# Altium schematic sheet PowerMonitors.SchDoc
size A; SheetNumber: 5; SheetTotal: 6
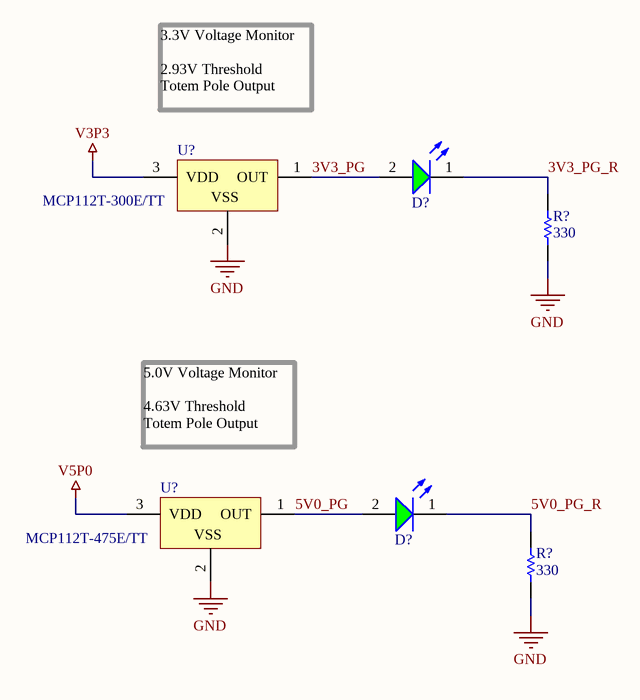
[diagram p0: PowerMonitors.SchDoc]

## Parts
(Parts that share a designator on the sheet are numbered #1, #2 ... from top to bottom, then left to right.)
D?#1  150080GS75000  [WL-SMCW_0805_150080xx75000]  (value not drawn)
D?#2  150080GS75000  [WL-SMCW_0805_150080xx75000]  (value not drawn)
R?#1  Resistance: 330  [RESC2013X60X35LL10T20]  (hidden comment: RC0805FR-07330RL)
R?#2  Resistance: 330  [RESC2013X60X35LL10T20]  (hidden comment: RC0805FR-07330RL)
U?#1  MCP112T-300E/TT  [SOT-23-TT3_L]
U?#2  MCP112T-475E/TT  [SOT-23-TT3_L]

## Nets
GND: R?#1.1 R?#2.1 U?#1.2(VSS) U?#2.2(VSS)
V3P3: U?#1.3(VDD)
V5P0: U?#2.3(VDD)
3V3_PG: D?#1.2(A) U?#1.1(OUT)
3V3_PG_R: D?#1.1(K) R?#1.2
5V0_PG: D?#2.2(A) U?#2.1(OUT)
5V0_PG_R: D?#2.1(K) R?#2.2

## Notes on the sheet
- 3.3V Voltage Monitor
  2.93V Threshold
  Totem Pole Output
- 5.0V Voltage Monitor
  4.63V Threshold
  Totem Pole Output

## Library data of the parts
D?#1 D?#2 = CMP-1426-00007-2: LED GREEN CLEAR 0805 SMD; NexarPartId: 29717780; Manufacturer: Wurth Electronics; Wavelength: 520nm; Forward Current: 100mA; Lens Style: Clear, Rectangular; Dominant Wavelength: 525nm; Max Junction Temperature (Tj): 95°C; Power Dissipation: 105mW; Luminous Intensity: 450mcd; Peak Wavelength: 515nm; Viewing Angle: 140°; Test Current: 20mA; Reverse Voltage: 5V; Forward Voltage: 3.2V; Lens Color: Colorless; Lens Size: 1.25mm; Mount: Surface Mount; REACH SVHC: Unknown; Min Operating Temperature: -40°C; Case Code (Imperial): 0805; Case/Package: 0805; Max Operating Temperature: 85°C; RoHS: Compliant; Length: 2mm; Height: 700µm; Width: 1.25mm; Color: Green; Case Code (Metric): 2012; Packaging: Tape and Reel; Max Reverse Voltage (DC): 5V; Supplier: Digikey; Supplier Part Number: 732-4983-1-ND; Manufacturer Part Number: 150080GS75000; Category: LEDs; Stock: 34895; Pricing: 1=0.19, 50=0.176, 100=0.151, 500=0.131 (USD); Mounting Technology: Surface Mount; Package Quantity: 1; Series: WL-SMCW; Lens Transparency: Clear; RoHS Compliant: Yes; Reach SVHC Compliant: Unknown; ComponentLink1URL: https://datasheet.ciiva.com/29563/150080gs75000-29563008.pdf?src-supplier=Digikey; ComponentLink1Description: https://datasheet.ciiva.com/29563/150080gs75000-29563008.pdf?src-supplier=Digikey; ComponentLink2URL: https://datasheet.ciiva.com/29279/759434-da-01-en-chipled-0805-w-kl-gruen-150080gs75000-29279039.pdf?src-supplier=Conrad; ComponentLink2Description: https://datasheet.ciiva.com/29279/759434-da-01-en-chipled-0805-w-kl-gruen-150080gs75000-29279039.pdf?src-supplier=Conrad
R?#1 R?#2 = CMP-2000-06960-1: Chip Resistor, 330 Ohm, +/- 1%, 125 mW, -55 to 155 degC, 0805 (2012 Metric), RoHS, Tape and Reel; Manufacturer: Yageo; Manufacturer Part Number: CRCW0805330RFKEA; Voltage Rating: 150V; Temperature Coefficient: 100PPM/C; Power Rating: 125mW(1/8W); Max Power Dissipation: 125mW; Value: 330R; Datasheet Version: Rev. 7, 05/2017; Termination Style: SMD/SMT; Case Code - mm: 2012; Package Description: 2-Pin Surface Mounted Device, Body 2 x 1.25 mm; Operating Temperature Range: -55Cto+155C; Case Code - in: 0805; Packaging: Reel; Tolerance: 1%; Package Reference: 0805; Mounting Technology: SurfaceMount; Product: ThickFilmResistorsGeneralPurpose; Series: RC; Manufacturer URL: http://www.yageo.com/; Datasheet URL: http://www.yageo.com/documents/recent/PYu-RC_Group_51_RoHS_L_7.pdf; Supplier 1: Digi-Key; Supplier Part Number 1: 311-330CRCT-ND; Manufacturer 1: Yageo; Manufacturer Part Number 1: RC0805FR-07330RL; RoHS: Yes; Category: Chip SMD Resistors; Stock 1: 1297787; Pricing 1: 1=0.10000, 10=0.03700, 100=0.01510, 1000=0.00680, 2500=0.00590 (USD); Case/Package: 0805; Case Code (Imperial): 0805; Case Code (Metric): 2012; Size Code: 0805; Min Operating Temperature: -55°C; Max Operating Temperature: 155°C; Package Quantity: 5000; Termination: SMD/SMT; Construction: Rectangular; Resistor Type: Thick Film; Number of Terminations: 2; Features: Moisture Resistant; Resistance Tolerance: 1%; Length: 0.079inch; Width: 0.049inch; Height: 0.024inch; Depth: 1.25mm; RoHS Compliant: Yes; Military Standard: Not; Lead Free: Lead Free; ComponentLink1URL: https://datasheet.ciiva.com/2457/pyu-r-int-thick-7-2457015.pdf?src-supplier=Digi-Key; ComponentLink1Description: https://datasheet.ciiva.com/2457/pyu-r-int-thick-7-2457015.pdf?src-supplier=Digi-Key; ComponentLink2URL: https://datasheet.ciiva.com/2457/pyu-r-int-thick-7-2457016.pdf?src-supplier=Digi-Key; ComponentLink2Description: https://datasheet.ciiva.com/2457/pyu-r-int-thick-7-2457016.pdf?src-supplier=Digi-Key; ComponentLink3URL: https://datasheet.ciiva.com/2457/pyu-r-int-thick-7-2457014.pdf?src-supplier=Digi-Key; ComponentLink3Description: https://datasheet.ciiva.com/2457/pyu-r-int-thick-7-2457014.pdf?src-supplier=Digi-Key; ComponentLink4URL: https://datasheet.ciiva.com/12667/rc0805-12667925.pdf?src-supplier=Mouser; ComponentLink4Description: https://datasheet.ciiva.com/12667/rc0805-12667925.pdf?src-supplier=Mouser; ComponentLink5URL: https://datasheet.ciiva.com/7941/444164-7941768.pdf?src-supplier=Element14; ComponentLink5Description: https://datasheet.ciiva.com/7941/444164-7941768.pdf?src-supplier=Element14; ComponentLink6URL: https://datasheet.ciiva.com/7941/444164-7941769.pdf?src-supplier=Element14; ComponentLink6Description: https://datasheet.ciiva.com/7941/444164-7941769.pdf?src-supplier=Element14; ComponentLink7URL: https://datasheet.ciiva.com/16740/rc0805-16740975.pdf?src-supplier=Future+Electronics; ComponentLink7Description: https://datasheet.ciiva.com/16740/rc0805-16740975.pdf?src-supplier=Future+Electronics; Supplier: Newark; Supplier Part Number: 53K0164; Stock: 218356; Pricing: 1=0.02, 25=0.02, 50=0.02, 100=0.02 (USD); Contact Plating: Tin; Weight: 0.000194oz; Voltage Rating (DC): 150V; Ratings: AEC-Q200; Reach SVHC Compliant: Unknown; ComponentLink8URL: https://datasheet.ciiva.com/5545/dcrcwe3-109170-5545357.pdf?src-supplier=Mouser; ComponentLink8Description: https://datasheet.ciiva.com/5545/dcrcwe3-109170-5545357.pdf?src-supplier=Mouser; ComponentLink9URL: https://datasheet.ciiva.com/8944/dcrcwe3-8944773.pdf?src-supplier=Avnet; ComponentLink9Description: https://datasheet.ciiva.com/8944/dcrcwe3-8944773.pdf?src-supplier=Avnet; ComponentLink10URL: https://datasheet.ciiva.com/8944/dcrcwe3-8944776.pdf?src-supplier=Avnet; ComponentLink10Description: https://datasheet.ciiva.com/8944/dcrcwe3-8944776.pdf?src-supplier=Avnet; ComponentLink11URL: https://datasheet.ciiva.com/2495/dcrcwe3-2495803.pdf?src-supplier=Digi-Key; ComponentLink11Description: https://datasheet.ciiva.com/2495/dcrcwe3-2495803.pdf?src-supplier=Digi-Key; ComponentLink12URL: https://datasheet.ciiva.com/2495/dcrcwe3-2495804.pdf?src-supplier=Digi-Key; ComponentLink12Description: https://datasheet.ciiva.com/2495/dcrcwe3-2495804.pdf?src-supplier=Digi-Key; ComponentLink13URL: https://datasheet.ciiva.com/2495/dcrcwe3-2495805.pdf?src-supplier=Digi-Key; ComponentLink13Description: https://datasheet.ciiva.com/2495/dcrcwe3-2495805.pdf?src-supplier=Digi-Key; ComponentLink14URL: https://datasheet.ciiva.com/16769/70201119-16769852.pdf?src-supplier=Allied+Electronics; ComponentLink14Description: https://datasheet.ciiva.com/16769/70201119-16769852.pdf?src-supplier=Allied+Electronics; ComponentLink15URL: https://datasheet.ciiva.com/7777/1697337-7777390.pdf?src-supplier=Element14; ComponentLink15Description: https://datasheet.ciiva.com/7777/1697337-7777390.pdf?src-supplier=Element14; ComponentLink16URL: https://datasheet.ciiva.com/7777/1720486-7777573.pdf?src-supplier=Element14; ComponentLink16Description: https://datasheet.ciiva.com/7777/1720486-7777573.pdf?src-supplier=Element14
U?#1 = CMP-0130-00043-1: 1.75Î¼A Micropower Voltage Detector, Push-Pull Output, 2.93V, 3-Pin SOT-23, Extended Temperature, Tape and Reel; Manufacturer 1: Microchip; Max Supply Voltage: 5.5V; Min Supply Voltage: 1V; Number of Voltages Monitored: 1; Operating Supply Current: 1.75uA; Reset: Active Low; Watchdog Timer: No; Max Reset Threshold Voltage: 2.974V; Min Reset Threshold Voltage: 2.886V; Quiescent Current: 1uA; Output: TOTEM-POLE; Code_IPC: SOT23-3; DatasheetVersion: revD, Jun-2005; PackageVersion: revBB, Aug-2009; PackageDescription: 3-Lead Plastic Small Outline Transistor (TT) [SOT-23]; PackageReference: SOT-23-TT3; Supplier 1: Digi-Key; Supplier Part Number 1: MCP112T-300E/TTCT-ND; Manufacturer Part Number 1: MCP112T-300E/TT; RoHS: Yes; Category: Voltage Supervisors; Stock 1: 3000; Pricing 1: 1=0.47000 (USD); Mount: Surface Mount; Case/Package: SOT-23-3; Number of Pins: 3; Min Operating Temperature: -40°C; Max Operating Temperature: 125°C; Package Quantity: 3000; Packaging: Tape and Reel; Type: Simple Reset/Power-On Reset,Voltage Detector; Threshold Voltage: 2.93V; Overvoltage Threshold: 2.974V; Undervoltage Threshold: 2.886V; Nominal Supply Current: 1uA; Max Supply Current: 1.75uA; Supply Current: 1uA; Length: 3.04mm; Width: 1.4mm; Height: 1.02mm; Radiation Hardening: No; Lead Free: Lead Free; RoHS Compliant: Yes; Reach SVHC Compliant: Yes; ComponentLink1URL: https://datasheet.ciiva.com/1170/21889d-1170325.pdf?src-supplier=Element14; ComponentLink1Description: https://datasheet.ciiva.com/1170/21889d-1170325.pdf?src-supplier=Element14; ComponentLink2URL: https://datasheet.ciiva.com/5696/21889d-5696088.pdf?src-supplier=Farnell; ComponentLink2Description: https://datasheet.ciiva.com/5696/21889d-5696088.pdf?src-supplier=Farnell; ComponentLink3URL: https://datasheet.ciiva.com/9215/21889d-9215429.pdf?src-supplier=Avnet; ComponentLink3Description: https://datasheet.ciiva.com/9215/21889d-9215429.pdf?src-supplier=Avnet; ComponentLink4URL: https://datasheet.ciiva.com/16388/filehandler-aspxddocname-en020167-16388517.pdf?src-supplier=Future+Electronics; ComponentLink4Description: https://datasheet.ciiva.com/16388/filehandler-aspxddocname-en020167-16388517.pdf?src-supplier=Future+Electronics; ComponentLink5URL: https://datasheet.ciiva.com/1971/21889d-1971982.pdf?src-supplier=Digi-Key; ComponentLink5Description: https://datasheet.ciiva.com/1971/21889d-1971982.pdf?src-supplier=Digi-Key; ComponentLink6URL: https://datasheet.ciiva.com/1971/21889d-1971983.pdf?src-supplier=Digi-Key; ComponentLink6Description: https://datasheet.ciiva.com/1971/21889d-1971983.pdf?src-supplier=Digi-Key; ComponentLink7URL: https://datasheet.ciiva.com/1971/21889d-1971981.pdf?src-supplier=Digi-Key; ComponentLink7Description: https://datasheet.ciiva.com/1971/21889d-1971981.pdf?src-supplier=Digi-Key; Supplier: Newark; Supplier Part Number: 56J7353; Manufacturer: Microchip; Manufacturer Part Number: MCP112T-300E/TT; Pricing: 3000=0.479 (USD); Mounting Technology: Surface Mount; Pins: 3
U?#2 = CMP-0130-00073-1: 1.75Î¼A Micropower Voltage Detector, Push-Pull Output, 4.63V, 3-Pin SOT-23, Extended Temperature, Tape and Reel; Manufacturer 1: Microchip; Min Supply Voltage: 1V; Max Supply Voltage: 5.5V; Number of Voltages Monitored: 1; Reset: Active Low; Overvoltage Threshold: 4.7V; Operating Supply Current: 1.75uA; Undervoltage Threshold: 4.561V; Watchdog Timer: No; Quiescent Current: 1uA; Output: TOTEM-POLE; PackageReference: SOT-23-TT3; DatasheetVersion: revD, Jun-2005; Code_IPC: SOT23-3; PackageDescription: 3-Lead Plastic Small Outline Transistor (TT) [SOT-23]; PackageVersion: revBB, Aug-2009; Supplier 1: Digi-Key; Supplier Part Number 1: MCP112T-475E/TTCT-ND; Manufacturer Part Number 1: MCP112T-475E/TT; RoHS: Yes; Category: Voltage Supervisors; Stock 1: 2981; Pricing 1: 1=0.6, 25=0.5, 100=0.46 (USD); Mounting Technology: Surface Mount; Case/Package: SOT-23-3; Pins: 3; Min Operating Temperature: -40°C; Max Operating Temperature: 125°C; Type: Simple Reset/Power-On Reset,Voltage Detector; Packaging: Tape and Reel; Package Quantity: 3000; Threshold Voltage: 4.63V; Max Supply Current: 1.75uA; Min Reset Threshold Voltage: 4.561V; Max Reset Threshold Voltage: 4.7V; Supply Current: 1uA; Length: 3.04mm; Width: 1.4mm; Height: 1.02mm; Reach SVHC Compliant: No; Lead Free: Lead Free; RoHS Compliant: Yes; ComponentLink1URL: https://datasheet.ciiva.com/1170/21889d-1170331.pdf?src-supplier=Element14; ComponentLink1Description: https://datasheet.ciiva.com/1170/21889d-1170331.pdf?src-supplier=Element14; ComponentLink2URL: https://datasheet.ciiva.com/9215/21889d-9215465.pdf?src-supplier=Avnet; ComponentLink2Description: https://datasheet.ciiva.com/9215/21889d-9215465.pdf?src-supplier=Avnet; ComponentLink3URL: https://datasheet.ciiva.com/1974/21889d-1974511.pdf?src-supplier=Digi-Key; ComponentLink3Description: https://datasheet.ciiva.com/1974/21889d-1974511.pdf?src-supplier=Digi-Key; ComponentLink4URL: https://datasheet.ciiva.com/1974/21889d-1974512.pdf?src-supplier=Digi-Key; ComponentLink4Description: https://datasheet.ciiva.com/1974/21889d-1974512.pdf?src-supplier=Digi-Key; ComponentLink5URL: https://datasheet.ciiva.com/1974/21889d-1974510.pdf?src-supplier=Digi-Key; ComponentLink5Description: https://datasheet.ciiva.com/1974/21889d-1974510.pdf?src-supplier=Digi-Key; Supplier: Newark; Supplier Part Number: 31T1312; Manufacturer: Microchip; Manufacturer Part Number: MCP112T-475E/TT; Pricing: 3000=0.488 (USD)